# EAGLE design Micro DAQ Board (EAGLE 5.06)
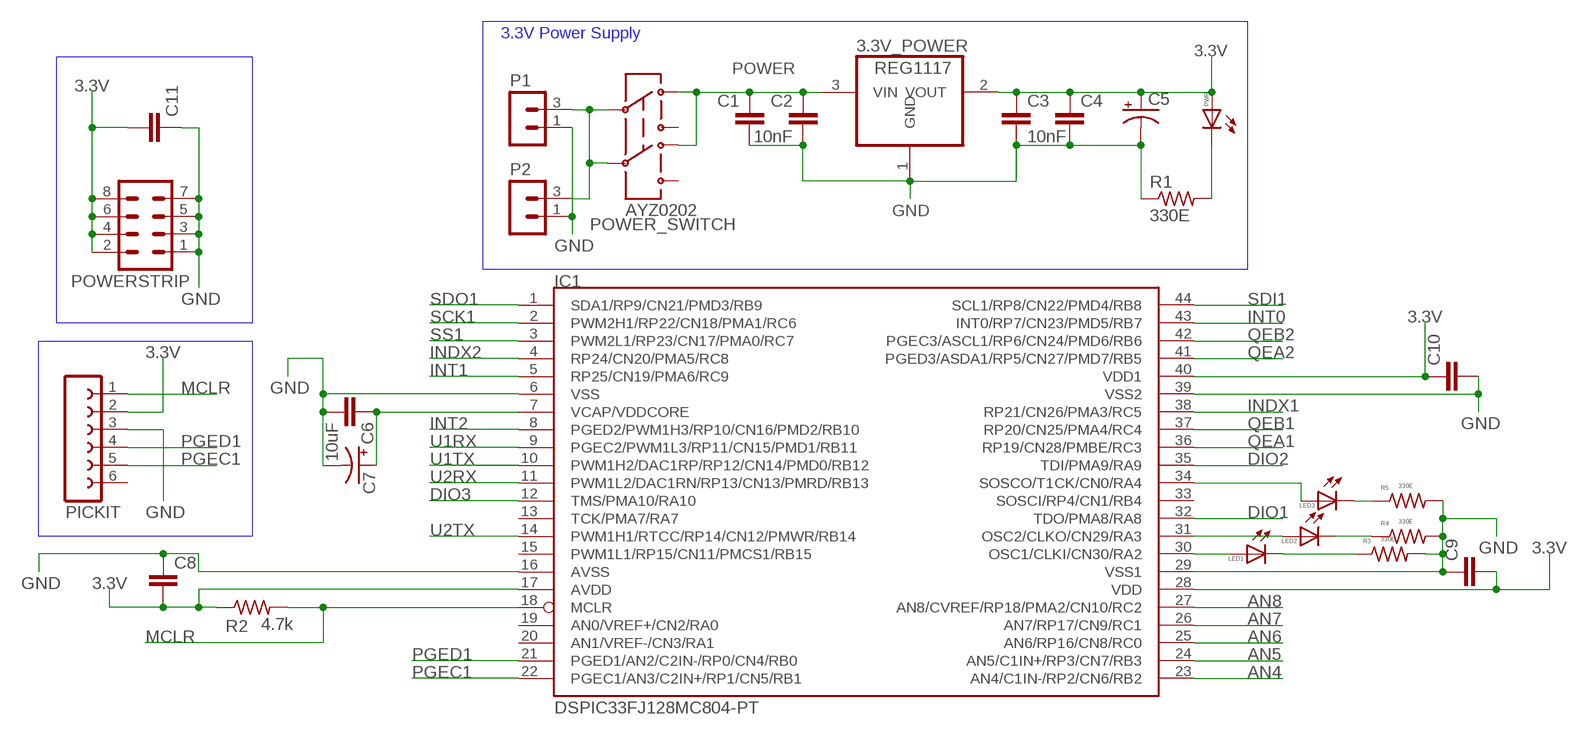
[diagram p0: schematic, sheet 1]

## Parts
3.3V_POWER  REG1117  [SOT223]
C1  C-EUC0805  [C0805]
C2  10nF  C-EUC0805  [C0805]
C3  10nF  C-EUC0805  [C0805]
C4  C-EUC0805  [C0805]
C5  CPOL-USE2.5-6  [E2,5-6]
C6  10uF  C-EUC0805  [C0805]
C7  CPOL-USE2.5-6  [E2,5-6]
C8  C-EUC0805  [C0805]
C9  C-EUC0805  [C0805]
C10  C-EUC0805  [C0805]
C11  C-EUC0805  [C0805]
IC1  DSPIC33FJ128MC804-PT  [TQFP44]
LED1  LEDCHIPLED_0805  [CHIPLED_0805]
LED2  LEDCHIPLED_0805  [CHIPLED_0805]
LED3  LEDCHIPLED_0805  [CHIPLED_0805]
P1  MA02-1  [MA02-1]
P2  MA02-1  [MA02-1]
PICKIT  FE06-1  [FE06]
POWER_SWITCH  AYZ0202  [AYZ0202]
POWERSTRIP  MA04-2  [MA04-2]
PWR  LEDCHIPLED_0805  [CHIPLED_0805]
R1  330E  R-US_R0805  [R0805]
R2  4.7k  R-US_R0805  [R0805]
R3  330E  R-US_R0805  [R0805]
R4  330E  R-US_R0805  [R0805]
R5  330E  R-US_R0805  [R0805]

## Nets
3.3V: 3.3V_POWER.2(VOUT) C3.1 C4.1 C5.+ C8.2 C9.2 C10.1 C11.2 IC1.17(AVDD) IC1.28(VDD) IC1.40(VDD1) PICKIT.2 POWERSTRIP.2 POWERSTRIP.4 POWERSTRIP.6 POWERSTRIP.8 PWR.A R2.1
AN4: IC1.23(AN4/C1IN-/RP2/CN6/RB2)
AN5: IC1.24(AN5/C1IN+/RP3/CN7/RB3)
AN6: IC1.25(AN6/RP16/CN8/RC0)
AN7: IC1.26(AN7/RP17/CN9/RC1)
AN8: IC1.27(AN8/CVREF/RP18/PMA2/CN10/RC2)
DIO1: IC1.32(TDO/PMA8/RA8)
DIO2: IC1.35(TDI/PMA9/RA9)
DIO3: IC1.12(TMS/PMA10/RA10)
GND: 3.3V_POWER.1(GND) C1.2 C2.2 C3.2 C4.2 C5.- C6.2 C7.- C8.1 C9.1 C10.2 C11.1 IC1.6(VSS) IC1.16(AVSS) IC1.29(VSS1) IC1.39(VSS2) P1.1 P2.1 PICKIT.3 POWERSTRIP.1 POWERSTRIP.3 POWERSTRIP.5 POWERSTRIP.7 R1.1 R3.2 R4.2 R5.2
INDX1: IC1.38(RP21/CN26/PMA3/RC5)
INDX2: IC1.4(RP24/CN20/PMA5/RC8)
INT0: IC1.43(INT0/RP7/CN23/PMD5/RB7)
INT1: IC1.5(RP25/CN19/PMA6/RC9)
INT2: IC1.8(PGED2/PWM1H3/RP10/CN16/PMD2/RB10)
MCLR: IC1.18(MCLR) PICKIT.1 R2.2
N$1: IC1.30(OSC1/CLKI/CN30/RA2) LED1.A
N$2: LED1.C R3.1
N$3: IC1.31(OSC2/CLKO/CN29/RA3) LED2.A
N$4: LED2.C R4.1
N$5: LED3.C R5.1
N$6: IC1.34(SOSCO/T1CK/CN0/RA4) LED3.A
N$7: P1.3 P2.3 POWER_SWITCH.2 POWER_SWITCH.5
N$15: PWR.C R1.2
PGEC1: IC1.22(PGEC1/AN3/C2IN+/RP1/CN5/RB1) PICKIT.5
PGED1: IC1.21(PGED1/AN2/C2IN-/RP0/CN4/RB0) PICKIT.4
POWER: 3.3V_POWER.3(VIN) C1.1 C2.1 POWER_SWITCH.3 POWER_SWITCH.6
QEA1: IC1.36(RP19/CN28/PMBE/RC3)
QEA2: IC1.41(PGED3/ASDA1/RP5/CN27/PMD7/RB5)
QEB1: IC1.37(RP20/CN25/PMA4/RC4)
QEB2: IC1.42(PGEC3/ASCL1/RP6/CN24/PMD6/RB6)
SCK1: IC1.2(PWM2H1/RP22/CN18/PMA1/RC6)
SDI1: IC1.44(SCL1/RP8/CN22/PMD4/RB8)
SDO1: IC1.1(SDA1/RP9/CN21/PMD3/RB9)
SS1: IC1.3(PWM2L1/RP23/CN17/PMA0/RC7)
U1RX: IC1.9(PGEC2/PWM1L3/RP11/CN15/PMD1/RB11)
U1TX: IC1.10(PWM1H2/DAC1RP/RP12/CN14/PMD0/RB12)
U2RX: IC1.11(PWM1L2/DAC1RN/RP13/CN13/PMRD/RB13)
U2TX: IC1.14(PWM1H1/RTCC/RP14/CN12/PMWR/RB14)
VCAP/VDDCORE: C6.1 C7.+ IC1.7(VCAP/VDDCORE)
Unconnected: IC1.13(TCK/PMA7/RA7) IC1.15(PWM1L1/RP15/CN11/PMCS1/RB15) IC1.19(AN0/VREF+/CN2/RA0) IC1.20(AN1/VREF-/CN3/RA1) IC1.33(SOSCI/RP4/CN1/RB4) PICKIT.6 POWER_SWITCH.1 POWER_SWITCH.4

## Notes on the sheet
- 3.3V Power Supply

## Library data of the parts
3.3V_POWER = burr-brown:REG1117: 800mA and 1A Low Dropout (LDO) Positive Regulator 1.8V, 2.5V, 2.85V, 3.3V, 5V, and Adj
C1-C4 C6 C8-C11 = rcl:C-EU: CAPACITOR, European symbol
C5 C7 = rcl:CPOL-US: POLARIZED CAPACITOR, American symbol
IC1 = microchip-dspic33fjxxmc:DSPIC33FJ128MC804: dsPIC33FJ32MC302/304, dsPIC33FJ64MCX02/X04, AND dsPIC33FJ128MCX02/X04 High-Performance, 16-bit Digital Signal Controllers Package:44 Pin TQFP Operating Range: * Up to 40 MIPS operation (at 3.0V -3.6V): - Industrial temperature range (-40°C to +85°C) - Extended temperature range (-40°C to +125°C) High-Performance DSC CPU: * Modified Harvard architecture * C compiler optimized instruction set * 16-bit wide data path * 24-bit wide instructions * Linear program memory addressing up to 4M instruction words * Linear data memory addressing up to 64 Kbytes * 83 base instructions: mostly 1 word/1 cycle * Two 40-bit accumulators with rounding and saturation options * Flexible and powerful addressing modes: - Indirect - Modulo - Bit-Reversed * Software stack * 16 x 16 fractional/integer multiply operations * 32/16 and 16/16 divide operations * Single-cycle multiply and accumulate: - Accumulator write back for DSP operations - Dual data fetch * Up to ±16-bit shifts for up to 40-bit data Direct Memory Access (DMA): * 8-channel hardware DMA * Up to 2 Kbytes dual ported DMA buffer area (DMA RAM) to store data transferred via DMA: - Allows data transfer between RAM and a peripheral while CPU is executing code (no cycle stealing) * Most peripherals support DMA Timers/Capture/Compare/PWM: * Timer/Counters, up to five 16-bit timers: - Can pair up to make two 32-bit timers - One timer runs as a Real-Time Clock with an external 32.768 kHz oscillator - Programmable prescaler * Input Capture (up to four channels): - Capture on up, down or both edges - 16-bit capture input functions - 4-deep FIFO on each capture * Output Compare (up to four channels): - Single or Dual 16-bit Compare mode - 16-bit Glitchless PWM mode * Hardware Real-Time Clock/Calendar (RTCC): - Provides clock, calendar, and alarm functions Interrupt Controller: * 5-cycle latency * Up to 53 available interrupt sources * Up to three external interrupts * Seven programmable priority levels * Five processor exceptions Digital I/O: * Peripheral pin Select functionality * Up to 35 programmable digital I/O pins * Wake-up/Interrupt-on-Change for up to 31 pins * Output pins can drive from 3.0V to 3.6V * Up to 5V output with open drain configuration * All digital input pins are 5V tolerant * 4 mA sink on all I/O pins On-Chip Flash and SRAM: * Flash program memory (up to 128 Kbytes) * Data SRAM (up to 16 Kbytes) * Boot, Secure, and General Security for program Flash System Management: * Flexible clock options: - External, crystal, resonator, internal RC - Fully integrated Phase-Locked Loop (PLL) - Extremely low jitter PLL * Power-up Timer * Oscillator Start-up Timer/Stabilizer * Watchdog Timer with its own RC oscillator * Fail-Safe Clock Monitor * Reset by multiple sources Power Management: * On-chip 2.5V voltage regulator * Switch between clock sources in real time * Idle, Sleep, and Doze modes with fast wake-up Analog-to-Digital Converters (ADCs): * 10-bit, 1.1 Msps or 12-bit, 500 Ksps conversion: - Two and four simultaneous samples (10-bit ADC) - Up to nine input channels with auto-scanning - Conversion start can be manual or synchronized with one of four trigger sources - Conversion possible in Sleep mode - ±2 LSb max integral nonlinearity - ±1 LSb max differential nonlinearity Audio Digital-to-Analog Converter (DAC): - 16-bit Dual Channel DAC module - 100 Ksps maximum sampling rate - Second-Order Digital Delta-Sigma Modulator Comparator Module: * Two analog comparators with programmable input/output configuration CMOS Flash Technology: * Low-power, high-speed Flash technology * Fully static design * 3.3V (±10%) operating voltage * Industrial and Extended temperature * Low power consumption Motor Control Peripherals: * 6-channel 16-bit Motor Control PWM: - Three duty cycle generators - Independent or Complementary mode - Programmable dead-time and output polarity - Edge-aligned or center-aligned - Manual output override control - One Fault input - Trigger for ADC conversions - PWM frequency for 16-bit resolution (@ 40 MIPS) = 1220 Hz for Edge-Aligned mode, 610 Hz for Center-Aligned mode - PWM frequency for 11-bit resolution (@ 40 MIPS) = 39.1 kHz for Edge-Aligned mode, 19.55 kHz for Center-Aligned mode * 2-channel 16-bit Motor Control PWM: - One duty cycle generator - Independent or Complementary mode - Programmable dead time and output polarity - Edge-aligned or center-aligned - Manual output override control - One Fault input - Trigger for ADC conversions - PWM frequency for 16-bit resolution (@ 40 MIPS) = 1220 Hz for Edge-Aligned mode, 610 Hz for Center-Aligned mode - PWM frequency for 11-bit resolution (@ 40 MIPS) = 39.1 kHz for Edge-Aligned mode, 19.55 kHz for Center-Aligned mode * 2-Quadrature Encoder Interface module: - Phase A, Phase B, and index pulse input - 16-bit up/down position counter - Count direction status - Position Measurement (x2 and x4) mode - Programmable digital noise filters on inputs - Alternate 16-bit Timer/Counter mode - Interrupt on position counter rollover/underflow
LED1-LED3 PWR = led:LED: LED OSRAM: - CHIPLED LG R971, LG N971, LY N971, LG Q971, LY Q971, LO R971, LY R971 LH N974, LH R974 LS Q976, LO Q976, LY Q976 LO Q996 - Hyper CHIPLED LW Q18S LB Q993, LB Q99A, LB R99A - SideLED LS A670, LO A670, LY A670, LG A670, LP A670 LB A673, LV A673, LT A673, LW A673 LH A674 LY A675 LS A676, LA A676, LO A676, LY A676, LW A676 LS A679, LY A679, LG A679 - Hyper Micro SIDELED® LS Y876, LA Y876, LO Y876, LY Y876 LT Y87S - SmartLED LW L88C, LW L88S LB L89C, LB L89S, LG L890 LS L89K, LO L89K, LY L89K LS L896, LA L896, LO L896, LY L896 - TOPLED LS T670, LO T670, LY T670, LG T670, LP T670 LSG T670, LSP T670, LSY T670, LOP T670, LYG T670 LG T671, LOG T671, LSG T671 LB T673, LV T673, LT T673, LW T673 LH T674 LS T676, LA T676, LO T676, LY T676, LB T676, LH T676, LSB T676, LW T676 LB T67C, LV T67C, LT T67C, LS T67K, LO T67K, LY T67K, LW E67C LS E67B, LA E67B, LO E67B, LY E67B, LB E67C, LV E67C, LT E67C LW T67C LS T679, LY T679, LG T679 LS T770, LO T770, LY T770, LG T770, LP T770 LB T773, LV T773, LT T773, LW T773 LH T774 LS E675, LA E675, LY E675, LS T675 LS T776, LA T776, LO T776, LY T776, LB T776 LHGB T686 LT T68C, LB T68C - Hyper Mini TOPLED® LB M676 - Mini TOPLED Santana® LG M470 LS M47K, LO M47K, LY M47K Source: http://www.osram.convergy.de LUXEON: - LUMILED® LXK2-PW12-R00, LXK2-PW12-S00, LXK2-PW14-U00, LXK2-PW14-V00 LXK2-PM12-R00, LXK2-PM12-S00, LXK2-PM14-U00 LXK2-PE12-Q00, LXK2-PE12-R00, LXK2-PE12-S00, LXK2-PE14-T00, LXK2-PE14-U00 LXK2-PB12-K00, LXK2-PB12-L00, LXK2-PB12-M00, LXK2-PB14-N00, LXK2-PB14-P00, LXK2-PB14-Q00 LXK2-PR12-L00, LXK2-PR12-M00, LXK2-PR14-Q00, LXK2-PR14-R00 LXK2-PD12-Q00, LXK2-PD12-R00, LXK2-PD12-S00 LXK2-PH12-R00, LXK2-PH12-S00 LXK2-PL12-P00, LXK2-PL12-Q00, LXK2-PL12-R00 Source: www.luxeon.com KINGBRIGHT: KA-3528ASYC Source: www.kingbright.com
P1 P2 = Pranjal:MA02-1
PICKIT = con-lsta:FE06-1: FEMALE HEADER
POWER_SWITCH = SparkFun:AYZ0202: SPDT Slide Switch Simple SMD single-pull double-throw slide switch. Good for less than 350mA power switch, switching UARTs between devices, etc. Spark Fun Electronics SKU : COM-00597
POWERSTRIP = con-lstb:MA04-2: PIN HEADER
R1-R5 = rcl:R-US_: RESISTOR, American symbol

## Board
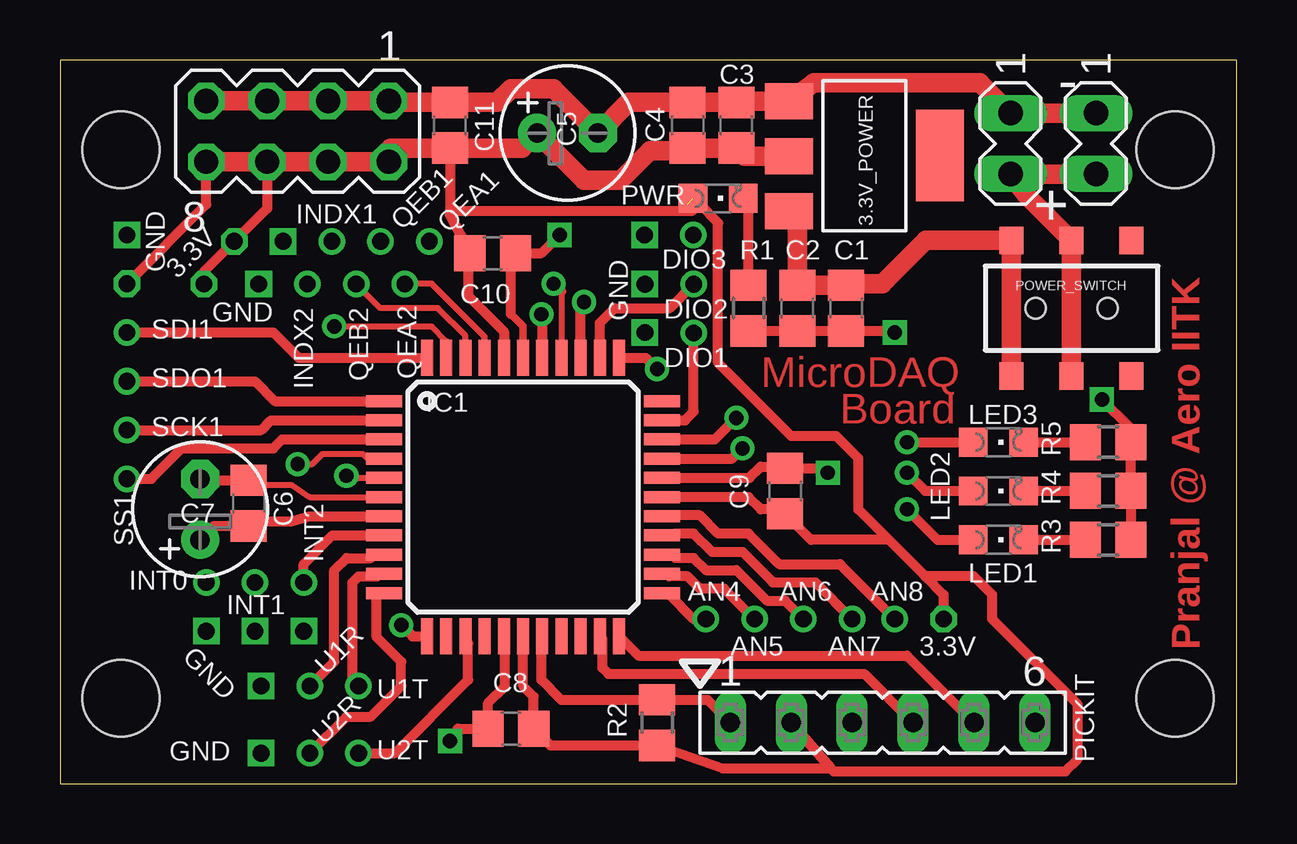
[diagram p1: board, top side]
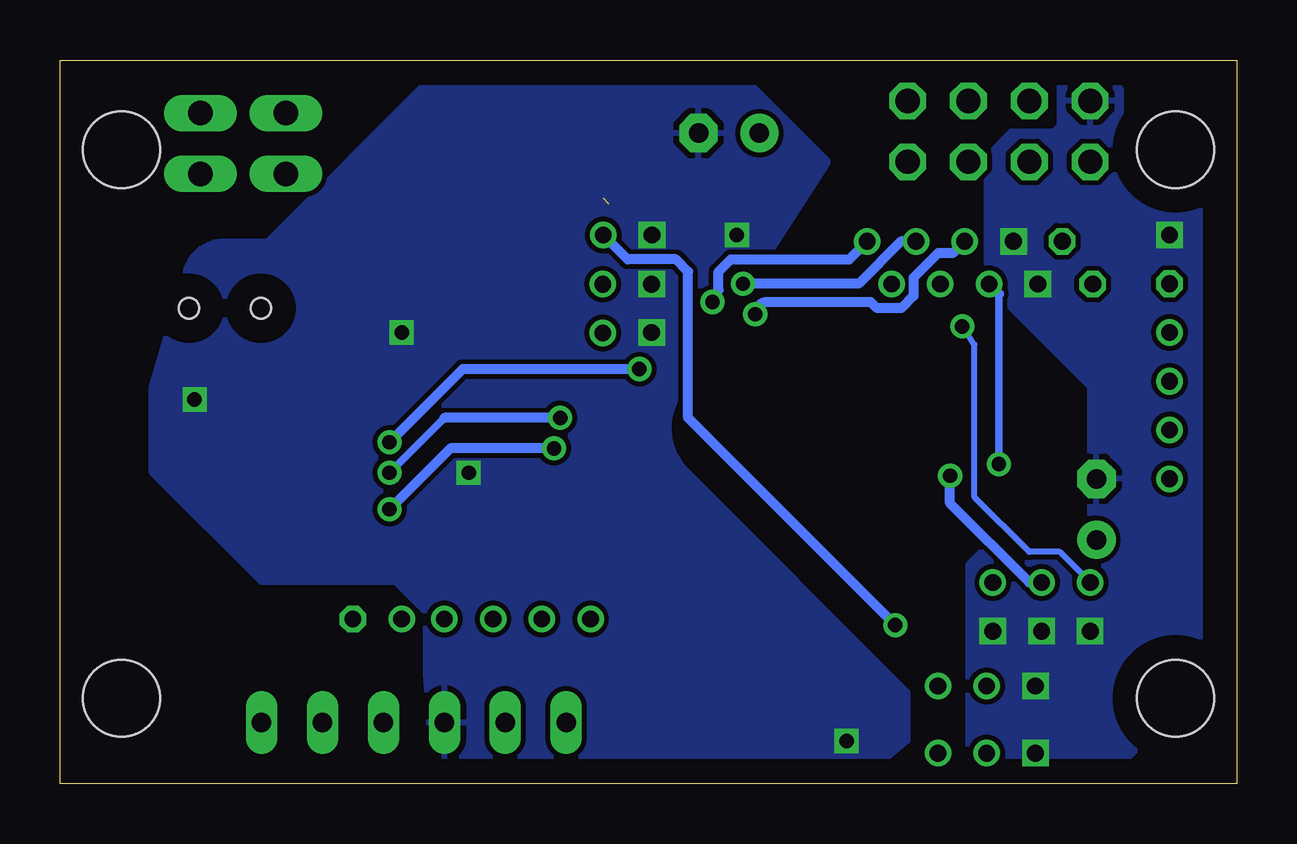
[diagram p2: board, bottom side, seen from below]

Size 49.04 x 30.15 mm. Coordinates in mm from the lower left corner, seen from the top.
Outline: 0,0 49.04,0 49.04,30.15 0,30.15 0,0
Copper layers (1*16): Top 0.035mm / dielectric 1.5mm / Bottom 0.035mm
Design rules "default": minimum track width 10mil, minimum drill 24mil, track to track 8mil, track to pad 8mil, pad to pad 8mil, via to via 8mil, smd to smd 8mil, copper to edge 40mil, drill to drill 8mil, minimum pad ring 10mil, minimum via ring 8mil, stop-mask expansion 4mil, vias tented up to drill 0mil, thermal gap 10mil
Holes 3.2 mm at 2.54,26.42 46.48,26.42 46.48,3.56 2.54,3.56

### Footprints (pad centres in the part's own frame; a part is rotated, then mirrored left to right if it is on the bottom)
SOT223 = smd 1.499 x 2.007: 1 -2.261,-3.15; 2 0.025,-3.15; 3 2.311,-3.15 | smd 3.81 x 2.007: 4 0,3.15
C0805 = smd 1.3 x 1.5: 1 -0.95,0; 2 0.95,0
E2,5-6 = drill 0.813 pad 1.6 round: + -1.27,0 | drill 0.813 pad 1.6 octagon: - 1.27,0
TQFP44 = smd 1.5 x 0.5: 1 -5.8,4; 2 -5.8,3.2; 3 -5.8,2.4; 4 -5.8,1.6; 5 -5.8,0.8; 6 -5.8,0; 7 -5.8,-0.8; 8 -5.8,-1.6; 9 -5.8,-2.4; 10 -5.8,-3.2; 11 -5.8,-4; 23 5.8,-4; 24 5.8,-3.2; 25 5.8,-2.4; 26 5.8,-1.6; 27 5.8,-0.8; 28 5.8,0; 29 5.8,0.8; 30 5.8,1.6; 31 5.8,2.4; 32 5.8,3.2; 33 5.8,4 | smd 0.5 x 1.5: 12 -4,-5.8; 13 -3.2,-5.8; 14 -2.4,-5.8; 15 -1.6,-5.8; 16 -0.8,-5.8; 17 0,-5.8; 18 0.8,-5.8; 19 1.6,-5.8; 20 2.4,-5.8; 21 3.2,-5.8; 22 4,-5.8; 34 4,5.8; 35 3.2,5.8; 36 2.4,5.8; 37 1.6,5.8; 38 0.8,5.8; 39 0,5.8; 40 -0.8,5.8; 41 -1.6,5.8; 42 -2.4,5.8; 43 -3.2,5.8; 44 -4,5.8
CHIPLED_0805 = smd 1.2 x 1.2: A 0,-1.05; C 0,1.05
MA02-1 = drill 1.016 long: 1 -1.27,0; 3 1.27,0
FE06 = drill 0.813 long: 1 -6.35,0; 2 -3.81,0; 3 -1.27,0; 4 1.27,0; 5 3.81,0; 6 6.35,0
AYZ0202 = smd 1 x 1.15: 1 -2.5,2.825; 2 0,2.825; 3 2.5,2.825; 4 -2.5,-2.825; 5 0,-2.825; 6 2.5,-2.825 | hole 0.85: 1.5,0; -1.5,0
MA04-2 = drill 1.016 octagon: 1 -3.81,-1.27; 2 -3.81,1.27; 3 -1.27,-1.27; 4 -1.27,1.27; 5 1.27,-1.27; 6 1.27,1.27; 7 3.81,-1.27; 8 3.81,1.27
R0805 = smd 1.3 x 1.5: 1 -0.95,0; 2 0.95,0

### Placement (x,y rotation side)
3.3V_POWER  33.53,26.16 270 top
C1  32.77,19.81 270 top
C2  30.73,19.81 270 top
C3  28.19,27.43 90 top
C4  26.16,27.43 90 top
C5  21.16,27.1 0 top
C6  7.87,11.68 90 top
C7  5.84,11.43 90 top
C8  18.8,2.29 0 top
C9  30.23,12.19 270 top
C10  18.03,22.1 0 top
C11  16.26,27.43 270 top
IC1  19.3,11.94 0 top
LED1  39.12,10.16 270 top
LED2  39.12,12.19 270 top
LED3  39.12,14.22 270 top
P1  43.18,26.67 270 top
P2  39.62,26.67 270 top
PICKIT  34.29,2.54 0 top
POWER_SWITCH  42.16,19.81 180 top
POWERSTRIP  9.91,27.18 180 top
PWR  27.43,24.38 270 top
R1  28.7,19.81 90 top
R2  24.89,2.54 90 top
R3  43.69,10.16 0 top
R4  43.69,12.19 0 top
R5  43.69,14.22 0 top

### Tracks (layer width: path | path; a pad name or v marks a point on that pad's centre or on a via)
3.3V  (via drill 0.7)  (1 unrouted)
  Top 0.406: IC1.28 28.7,11.94 29.21,11.43 30.04,11.43 C9.2 31.31,10.16 34.54,10.16 | IC1.17 19.3,4.06 19.75,3.62 C8.2 20.44,1.59 R2.1 | R2.1 24.89,1.52 | 32.13,0.64 32.26,0.51 41.91,0.51 42.42,1.02 42.42,3.3 38.86,6.86 38.86,7.87 38.1,8.64 36.07,8.64 | 32.13,0.64 PICKIT.2 | 36.07,8.64 34.54,10.16 | R2.1 27.62,0.64 32.13,0.64 | v36.83,6.86 36.83,7.87 36.07,8.64 | POWERSTRIP.8 6.1,24.13 v2.79,20.83 | POWERSTRIP.6 8.64,23.96 v7.27,22.59 6,21.32 v6,20.82 | IC1.40 18.5,18.83 17.02,20.32 17.02,22.03 C10.1 16.26,23.69 16.26,23.88 | C11.2 16.26,23.88 | PWR.A 26.38,23.88 16.26,23.88 | 26.16,24.13 26.67,24.13 27.43,23.37 27.43,17.53 30.48,14.48 32.36,14.48 33.27,13.56 33.27,11.43 34.54,10.16
  Top 0.813: 3.3V_POWER.2 28.54,26.14 C3.1 C4.1 26.04,26.36 24.59,26.36 23.37,25.15 21.84,25.15 C5.+ 19.27,26.48 C11.2 13.78,26.48 POWERSTRIP.2 POWERSTRIP.4 POWERSTRIP.6 POWERSTRIP.8
DIO1  (via drill 0.7)
  Top 0.406: IC1.32 26.06,15.14 26.42,15.49 v26.42,18.78 | v26.42,18.78
DIO2  (via drill 0.7)
  Top 0.406: IC1.35 22.5,19.2 23.11,19.81 25.42,19.81 v26.42,20.81
DIO3  (via drill 0.6, 0.7)
  Top 0.406: IC1.12 14.69,6.14 v14.22,6.6
  Bottom 0.406: v14.22,6.6 22.86,15.24 22.86,21.34 23.37,21.84 25.38,21.84 v26.4,22.86
GND  (via drill 0.6, 0.7)
  Top 0.254: IC1.6 10.41,11.94 9.65,12.45 8.06,12.45
  Top 0.305: IC1.39 19.3,19.05 18.8,19.56
  Top 0.406: IC1.29 28.74,12.74 29.21,13.21 30.16,13.21 C9.1 31.82,13.14 v32,12.95 | 8.06,12.45 C6.2 5.91,12.63 C7.- | R3.2 R4.2 R5.2 44.64,14.8 v43.43,16 | R1.1 C2.2 C1.2 34.73,18.86 v34.8,18.8 | IC1.16 18.54,6.1 18.54,4.06 17.85,3.37 C8.1 16.58,2.29 v16.26,1.78 | 18.8,19.56 18.8,21.91 C10.2 20.07,22.1 v20.83,22.86
  Top 0.813: POWERSTRIP.7 POWERSTRIP.5 POWERSTRIP.3 POWERSTRIP.1 13.27,28.38 C11.1 18.22,28.38 18.8,28.96 20.57,28.96 C5.- 23.7,28.38 C4.2 C3.2 28.23,28.42 3.3V_POWER.1 31.42,29.21 38.35,29.21 P2.1 P1.1
  other vias: 8.38,4.06 8.38,1.27 8.28,20.82 9.3,22.59 2.79,22.86 24.37,22.86 24.38,20.81 24.38,18.8 6.1,6.35 8.13,6.35 10.16,6.35
  pour Bottom: 33.53,29.46 20.57,29.46 17.02,25.91 23.27,16.2 arc-78 22.93,13.03 13.72,3.81 13.72,1.78 15.24,0.51 32.54,0.51 arc86 33.59,1.49 33.78,4.57 33.78,7.11 35.05,8.38 40.64,8.38 45.21,12.95 45.21,16.51 43.79,21.38 arc74 42.16,22.61 40.39,22.61
  pour Bottom: 7.37,29.21 6.86,29.72 5.59,29.72 4.83,28.96 4.83,25.65 4.32,25.15 2.29,25.15 1.52,24.38 1.52,5.33 3.3,5.08 3.3,2.29 5.08,0.51 10.92,0.51 11.18,0.76 11.18,9.14 10.16,10.16 6.6,10.16 6.1,10.67 6.1,16.51 10.41,20.83 10.41,26.16 9.4,27.18 7.62,27.18 7.37,27.43
INDX1  (via drill 0.6, 0.7)
  Top 0.406: IC1.38 20.1,19.27 v20.07,19.56
  Bottom 0.406: v20.07,19.56 arc90 19.56,20.07 15.24,20.07 14.99,19.81 13.97,19.81 13.46,20.32 13.46,21.08 12.45,22.1 11.82,22.1 v11.33,22.59
INDX2  (via drill 0.6, 0.7)
  Top 0.254: IC1.4 12.83,13.54 12.62,13.74 10.95,13.74 10.52,13.31 v9.91,13.31
  Bottom 0.305: v9.91,13.31 9.91,20.41
  Bottom 0.406: 9.91,20.41 v10.31,20.82
INT0  (via drill 0.6, 0.7)
  Top 0.254: IC1.43 16.1,18.44 15.49,19.05 v11.43,19.05
  Bottom 0.254: v11.43,19.05 10.92,18.29 10.92,11.94 8.64,9.65 7.37,9.65 v6.1,8.38
INT1  (via drill 0.6, 0.7)
  Top 0.254: IC1.5 12.03,12.74 v11.94,12.83
  Bottom 0.406: v11.94,12.83 11.94,11.68 8.64,8.38 v8.13,8.38
INT2  (via drill 0.7)
  Top 0.406: IC1.8 11.35,10.34 10.16,9.14 v10.16,8.38
MCLR
  Top 0.406: IC1.18 20.07,6.1 20.07,4.32 20.89,3.49 R2.2 26.99,3.49 PICKIT.1
N$1  (via drill 0.6)
  Top 0.406: IC1.30 28.02,13.54 v28.45,13.97 | v35.31,11.43 36.58,10.16 LED1.A
  Bottom 0.406: v28.45,13.97 32.77,13.97 v35.31,11.43
N$2
  Top 0.406: LED1.C R3.1
N$3  (via drill 0.6)
  Top 0.406: IC1.31 27.29,14.34 v28.19,15.24 | v35.31,12.95 36.07,12.19 LED2.A
  Bottom 0.305: 33.02,15.24 v35.31,12.95
  Bottom 0.406: v28.19,15.24 33.02,15.24
N$4
  Top 0.406: LED2.C R4.1
N$5
  Top 0.406: LED3.C R5.1
N$6  (via drill 0.6)
  Top 0.406: IC1.34 24.43,17.74 v24.89,17.27 | v35.31,14.22 LED3.A
  Bottom 0.406: v24.89,17.27 32.26,17.27 v35.31,14.22
N$7
  Top 0.813: P1.3 P2.3 40.39,24.41 POWER_SWITCH.5 POWER_SWITCH.2
N$8  (via drill 0.7)
  Top 0.406: 25.4,7.87 26.42,6.86 v26.92,6.86
N$9  (via drill 0.7)
  Top 0.406: 25.4,8.64 26.16,8.64 26.67,8.13 27.69,8.13 v28.96,6.86
N$10  (via drill 0.7)
  Top 0.406: 25.65,9.4 26.42,9.4 26.92,8.89 28.19,8.89 29.46,7.62 30.23,7.62 v30.99,6.86
N$11  (via drill 0.7)
  Top 0.406: 25.65,11.18 26.67,11.18 27.43,10.41 28.7,10.41 29.97,9.14 32.51,9.14 v34.8,6.86
N$12  (via drill 0.7)
  Top 0.406: 25.65,10.41 26.42,10.41 27.18,9.65 28.45,9.65 29.72,8.38 31.5,8.38 v33.02,6.86
N$13  (via drill 0.7)
  Top 0.406: 13.21,8.64 12.45,8.64 12.19,8.38 12.19,4.32 v12.45,4.06
N$14  (via drill 0.7)
  Top 0.406: 12.95,9.4 11.94,9.4 11.43,8.89 11.43,5.08 v10.41,4.06
N$15
  Top 0.406: 28.6,20.86 R1.2 28.7,24.38 PWR.C
N$20  (via drill 0.7)
  Top 0.406: 17.02,5.84 17.02,4.32 13.97,1.27 v12.45,1.27
N$21  (via drill 0.7)
  Top 0.406: 13.21,7.87 13.21,6.1 14.22,5.08 14.22,4.06 12.95,2.79 11.94,2.79 v10.41,1.27
PGEC1
  Top 0.406: PICKIT.5 35.31,5.33 24.11,5.33 IC1.22
PGED1
  Top 0.406: PICKIT.4 33.53,4.57 22.86,4.57 22.61,4.83 22.61,6.04 IC1.21
POWER
  Top 0.813: POWER_SWITCH.3 POWER_SWITCH.6 36.1,22.64 34.29,20.83 32.83,20.83 C1.1 C2.1 30.73,23.75 3.3V_POWER.3
QEA1  (via drill 0.6, 0.7)
  Top 0.406: IC1.36 21.7,19.67 v21.84,20.07
  Bottom 0.406: v21.84,20.07 21.59,20.57 21.59,21.34 21.08,21.84 16.14,21.84 v15.39,22.59
QEA2  (via drill 0.7)
  Top 0.254: IC1.41 17.7,18.62 15.49,20.83 v14.39,20.83 v14.38,20.82
QEB1  (via drill 0.6, 0.7)
  Top 0.254: 20.9,20.5 IC1.37
  Top 0.406: v20.57,20.83 20.9,20.5
  Bottom 0.406: v20.57,20.83 15.75,20.83 13.98,22.59 v13.36,22.59
QEB2  (via drill 0.7)
  Top 0.254: IC1.42 16.9,18.66 15.75,19.81 13.35,19.81 v12.35,20.82
SCK1  (via drill 0.7)
  Top 0.406: IC1.2 8.79,15.14 8.38,14.73 v2.79,14.73
SDI1  (via drill 0.7)
  Top 0.406: IC1.44 9.95,17.74 8.89,18.8 v2.79,18.8
SDO1  (via drill 0.7)
  Top 0.406: IC1.1 8.95,15.94 8.13,16.76 v2.79,16.76
SS1  (via drill 0.7)
  Top 0.406: IC1.3 9.26,14.34 8.89,13.97 5.08,13.97 3.81,12.7 v2.79,12.7
VCAP/VDDCORE
  Top 0.406: IC1.7 10.38,11.14 9.65,10.92 8.06,10.92 C6.1 6.42,10.73 C7.+

### Text on the board
Top: MicroDAQ | Board | Pranjal @ Aero IITK
_tsilk: - | GND | INDX1 | QEB1 | QEA1 | + | GND | 3.3V | DIO3 | GND | INDX2 | QEB2 | QEA2 | SDI1 | DIO2 | SDO1 | DIO1 | SCK1 | INT2 | SS1 | INT0 | INT1 | AN4 | AN6 | AN8 | AN5 | AN7 | 3.3V | GND | U1R | U1T | GND | U2R | U2T